# Altium project hv_pcb_v2_pulser_fix.PrjPcb
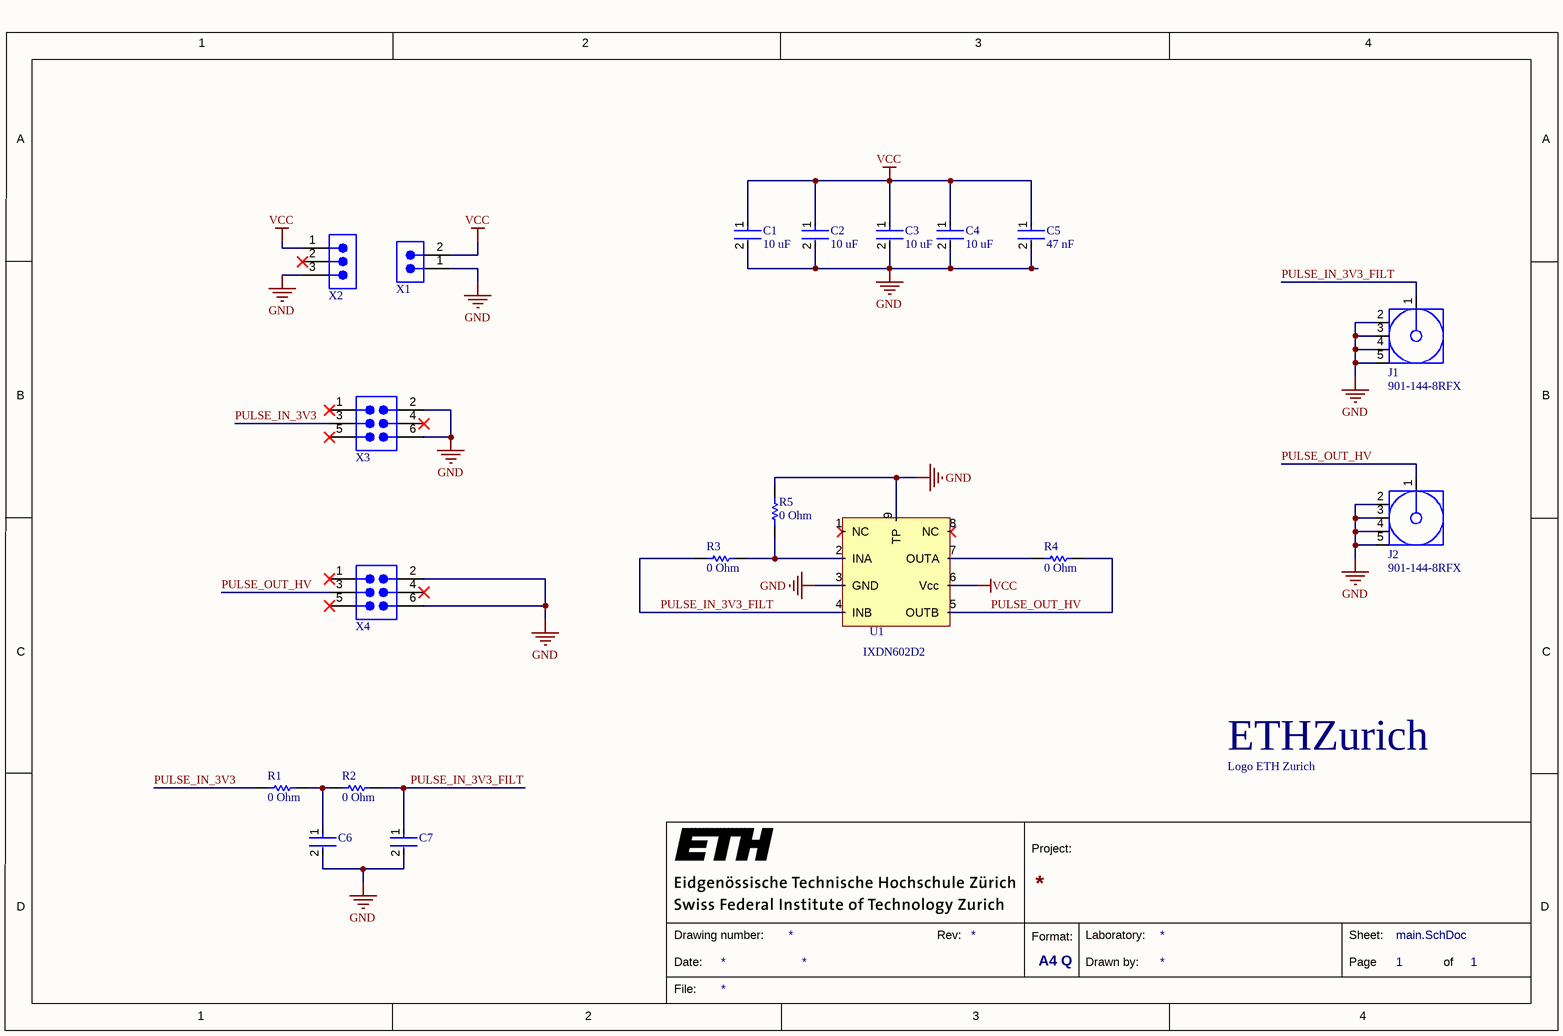
[diagram p0: main.SchDoc]
1 sheet, 20 parts. Net scope: global (net labels, ports and power ports of the same name join across sheets).
Board file: PCB.PcbDoc

## Sheet main.SchDoc
size A4; SheetNumber: 1; SheetTotal: 1

### Parts
A?  Logo ETH Zurich  [eth-zurich_2mm]  (no BOM)
C1  10 uF  [FP-GRM188-0_2-IPC_C]
C2  10 uF  [FP-GRM188-0_2-IPC_C]
C3  10 uF  [FP-GRM188-0_2-IPC_C]
C4  10 uF  [FP-GRM188-0_2-IPC_C]
C5  47 nF  [FP-CGAEA-MFG]
C6  C0402C100J3GACTU  [FP-C0402-BB-MFG]  (value not drawn)
C7  C0402C100J3GACTU  [FP-C0402-BB-MFG]  (value not drawn)
J1  901-144-8RFX  [AMPH-901-144-8RFX_V]
J2  901-144-8RFX  [AMPH-901-144-8RFX_V]
R1  0 Ohm  [RESC1005X40X25NL05T10]
R2  0 Ohm  [RESC1005X40X25NL05T10]
R3  0 Ohm  [RESC1005X40X25NL05T10]
R4  0 Ohm  [RESC1005X40X25NL05T10]
R5  0 Ohm  [RESC1005X40X25NL05T10]
U1  IXDN602D2  [IXDN602D2]
X1  68000-102HLF  [68000-102HLF]  (value not drawn)
X2  68000-103HLF  [68000-103HLF]  (value not drawn)
X3  67996-106HLF  [67996-106HLF]  (value not drawn)
X4  67996-106HLF  [67996-106HLF]  (value not drawn)

### Nets
GND: C1.2 C2.2 C3.2 C4.2 C5.2 C6.2 C7.2 J1.2 J1.3 J1.4 J1.5 J2.2 J2.3 J2.4 J2.5 R5.2 U1.3(GND) U1.9(TP) X1.1 X2.3 X3.2 X3.6 X4.2 X4.6
VCC: C1.1 C2.1 C3.1 C4.1 C5.1 U1.6(Vcc) X1.2 X2.1
PULSE_IN_3V3: R1.2 X3.3
PULSE_IN_3V3_FILT: C7.1 J1.1 R2.1 R3.1 U1.4(INB)
PULSE_OUT_HV: J2.1 R4.2 U1.5(OUTB) X4.3
NetC6_1: C6.1 R1.1 R2.2
NetR3_2: R3.2 R5.1 U1.2(INA)
NetR4_1: R4.1 U1.7(OUTA)

Not connected (* = marked no-connect by the designer): U1 1(NC)* 8(NC)*; X2 2*; X3 1* 4* 5*; X4 1* 4* 5*

### Notes on the sheet
- 1
- 2
- 3
- 4
- A
- B
- C
- Project:
- D
- Date:
- Drawing number:
- Rev:
- Format:
- A4 Q
- Drawn by:
- Laboratory:
- Page
- Sheet:
- of
- File:
- (in symbol CMP-00038-1) ETHZurich

### Library data of the parts
A? = CMP-00038-1
C1-C4 = CMP-06035-042125-1: Chip Multilayer Ceramic Capacitors for General Purpose, 0603, 2.2uF, X5R, 15%, 10%, 50V GRM188R61H225KE11D; Case Code (Metric): 1608; Packaging: Cut Tape; REACH SVHC: No SVHC; Material: Ceramic; Voltage Rating: 50V; Min Operating Temperature: -55°C; Length: 0.063inch; Case Code (Imperial): 0603; Tolerance: 10%; Capacitance: 2.2uF; Thickness: 0.039inch; Height: 0.8mm; Case/Package: 0603; Voltage Rating (DC): 50V; Dielectric: X5R; Mount: Surface Mount; Max Operating Temperature: 85°C; Width: 0.031inch
C5 = CMP-08246-002687-1: CAP CER 0.047UF 50V X7R 0204  CGAEA1X7R1H473M030BC; RoHS Compliant: No
C6 C7 = CMP-1034-00716-4: CAP CER 10PF 25V 5% NP0 0402; Manufacturer: Kemet; Temperature Characteristic: C0G; Material: Ceramic; Temperature Coefficient: 15%; Tolerance: 0.05; Octopart: https://octopart.com/c0402c100j3gactu-kemet-9138549; Lead Free: Yes; Automotive: No; Value: 10 pF; Voltage Rating: 25 V; RoHS: TRUE; Device Class L2: Capacitors; Capacitance: 10 pF; Category: Cap; Temperature Range High: +125°C; ComponentLink2URL: https://content.kemet.com/datasheets/KEM_C1002_X7R_SMD.pdf; Temperature: -55°C to +125°C; Temperature Range Low: -55°C; Device Class L3: Ceramic Capacitors; Device Class L1: Passive Components; Mouser Description: Multilayer Ceramic Capacitors MLCC - SMD/SMT 25volts 10pF C0G 5%; ComponentLink2Description: Datasheet; Manufacturer Part Number: C0402C100J3GACTU; Package: C0402-BB; Height: 0.55mm; Ipc Land Pattern Name: CAPC10050X50; Digikey Description: CAP CER 10PF 25V 5% NP0 0402
J1 J2 = CMP-2000-05706-1: Coaxial Connector, 18 GHz, 50 Ohm, -65 to 165 degC, 5-Pin THD, RoHS, Bulk; Manufacturer: Amphenol; Contact Termination: Solder; Dielectric Material: Polytetrafluoroethylene(PTFE); Frequency - Max: 18GHz; Body Material: Brass; Other Names: 901-144-8-RFX9011448RFXARFX1231; Center Contact Plating: Gold; Connector Type: Jack,FemaleSocket; Center Contact Material: BerylliumCopper; Impedance: 50Ohm; 3D Model: 901-144-8RFX.igs; Online Catalog: SMA,RFX; Connector Style: SMA; Category: Connectors,Interconnects; Housing Color: Gold; Mounting Type: ThroughHole; Ingress Protection: -; Packaging: Bulk; Features: -; Fastening Type: Threaded; Series: -; Standard Package: 1; Shield Termination: Solder; Mounting Technology: SurfaceMount; Family: CoaxialConnectors(RF); Package Reference: 901-144-8RFX; Datasheet URL: https://datasheet.ciiva.com/23676/c901-144-8rfx-23676337.pdf; Package Description: 5-Pin Through Hole Device, Body 7 x 7 mm, Pitch 2.54 mm; Cable Group: -; Datasheet Version: Rev. A, 01/2001; Body Finish: Gold; Operating Temperature: -65°C~165°C; Voltage Rating: -; Manufacturer URL: http://www.amphenol.com/
R1-R5 = CMP-1011-00001-2: Manufacturer: Yageo / Phycomp; Part Number: RC0402JR-070RL
U1 = IXDN602D2: IXD_602 / 2-Ampere Dual Low-Side / Ultrafast MOSFET Drivers
X1 = CMP-00100-3: Manufacturer: Amphenol FCI; Pitch: 2.54mm; Number of Positions: 2; Connector Type: Male Pin; Current Rating: 3A; Gender: Male; Insulation Resistance: 5GR; Mating Post Length: 5.84mm; Max Voltage Rating (AC): 1.5kV; Packaging: Bulk; Supplier: Digikey; Supplier Part Number: 609-3500-ND; ComponentLink1Description: 68000-274228-5149165.pdf; ComponentLink1URL: https://datasheet.ciiva.com/5149/68000-274228-5149165.pdf; Manufacturer Part Number: 68000-102HLF; Number of Rows: 1; Termination: Solder; Contact Mating Length: 0.23inch; Case/Package: 100; Colour: Black; ComponentLink2Description: 68000-722084.pdf; ComponentLink2URL: https://datasheet.ciiva.com/722/68000-722084.pdf; ComponentLink3Description: 68000-10149324.pdf; ComponentLink3URL: https://datasheet.ciiva.com/10149/68000-10149324.pdf; ComponentLink4Description: 68000-16726309.pdf; ComponentLink4URL: https://datasheet.ciiva.com/16726/68000-16726309.pdf; Contact Gender: Male; Contact Material: Bronze; Contact Plating: Nickel,Gold,GXT; Depth: 2.41mm; Flammability Rating: UL94 V-0; Housing Colour: Black; Housing Material: Thermoplastic; Lead Free: Lead Free; Length: 5.08mm; Max Operating Temperature: 125°C; Min Operating Temperature: -65°C; Number of Contacts: 2; Orientation: Straight; Package Quantity: 100; Radiation Hardening: No; Termination Post Length: 2.41mm; Voltage Rating: 1.5kV; Voltage Rating (DC): 1.5kV
X2 = CMP-00101-2: 3 Positions Header, Unshrouded Connector 0.100" (2.54mm) Through Hole Gold or Gold, GXT™; Manufacturer: Amphenol FCI; Current Rating: 3A; Insulation Resistance: 5GR; Number of Positions: 3; Max Voltage Rating (AC): 1.5kV; Termination: Solder; Fastening Type: -; Features: -; Contact Finish: Gold or Gold, GXT™; Contact Finish Thickness: 15µin (0.38µm); Color: Black; Supplier: Digikey; Supplier Part Number: 609-3461-ND; ComponentLink1Description: 68000-274283-5157301.pdf; ComponentLink1URL: https://datasheet.ciiva.com/5157/68000-274283-5157301.pdf; Depth: 2.41mm; Flammability Rating: UL94 V-0; Housing Colour: Black; Housing Material: Thermoplastic; Length: 7.62mm; Manufacturer Part Number: 68000-103HLF; Max Operating Temperature: 125°C; Packaging: Bulk; Contact Type: Male Pin; Connector Type: Header, Unshrouded; Pitch: 2.54mm; Number of Rows: 1; Contact Mating Length: 0.230" (5.84mm); Mounting Type: Through Hole; Min Operating Temperature: -65°C; Number of Contacts: 3; Orientation: Straight; Package Quantity: 100; Radiation Hardening: No; REACH SVHC: No SVHC; Termination Post Length: 2.41mm; Voltage Rating: 1.5kV; Contact Gender: Male; Contact Material: Bronze; Contact Plating: Nickel,Gold,GXT; ComponentLink2Description: 68000-731071.pdf; ComponentLink2URL: https://datasheet.ciiva.com/731/68000-731071.pdf; ComponentLink3Description: 68000-10149754.pdf; ComponentLink3URL: https://datasheet.ciiva.com/10149/68000-10149754.pdf; ComponentLink4Description: 1914865-46392021.pdf; ComponentLink4URL: https://datasheet.ciiva.com/46392/1914865-46392021.pdf
X3 X4 = CMP-00150-2: 6 Positions Header, Unshrouded Connector 0.100" (2.54mm) Through Hole Gold or Gold, GXT™; Manufacturer: Amphenol FCI; Connector Type: Male Pin; Number of Positions: 6; Row Spacing: 0.1inch; Current Rating: 3A; Gender: Male; Insulation Resistance: 5GR; Mating Post Length: 5.84mm; Max Voltage Rating (AC): 1.5kV; Packaging: Bulk; Pitch: 2.54mm; Number of Rows: 2; Contact Mating Length: 0.23inch; Termination: Solder; Manufacturer Part Number: 67996-106HLF; Supplier: Digikey; Supplier Part Number: 609-3202-ND; ComponentLink1Description: 67996-16726269.pdf; ComponentLink1URL: https://datasheet.ciiva.com/16726/67996-16726269.pdf; Case/Package: 100; Colour: Black; ComponentLink2Description: 1876884-46393071.pdf; ComponentLink2URL: https://datasheet.ciiva.com/46393/1876884-46393071.pdf; ComponentLink3Description: 67996-728918.pdf; ComponentLink3URL: https://datasheet.ciiva.com/728/67996-728918.pdf; ComponentLink4Description: 67996-10149181.pdf; ComponentLink4URL: https://datasheet.ciiva.com/10149/67996-10149181.pdf; Contact Gender: Male; Contact Material: Bronze; Contact Plating: Nickel,Gold,GXT; Depth: 4.83mm; Flammability Rating: UL94 V-0; Housing Colour: Black; Housing Material: Thermoplastic; Length: 7.62mm; Max Operating Temperature: 125°C; Min Operating Temperature: -65°C; Number of Contacts: 6; Orientation: Straight; Package Quantity: 100; Radiation Hardening: No; REACH SVHC: No SVHC; Termination Post Length: 2.41mm; Voltage Rating: 1.5kV

## Assembly variants
fabrication: not fitted C1 C6 C7